# EAGLE design EMG (EAGLE 9.6.2)
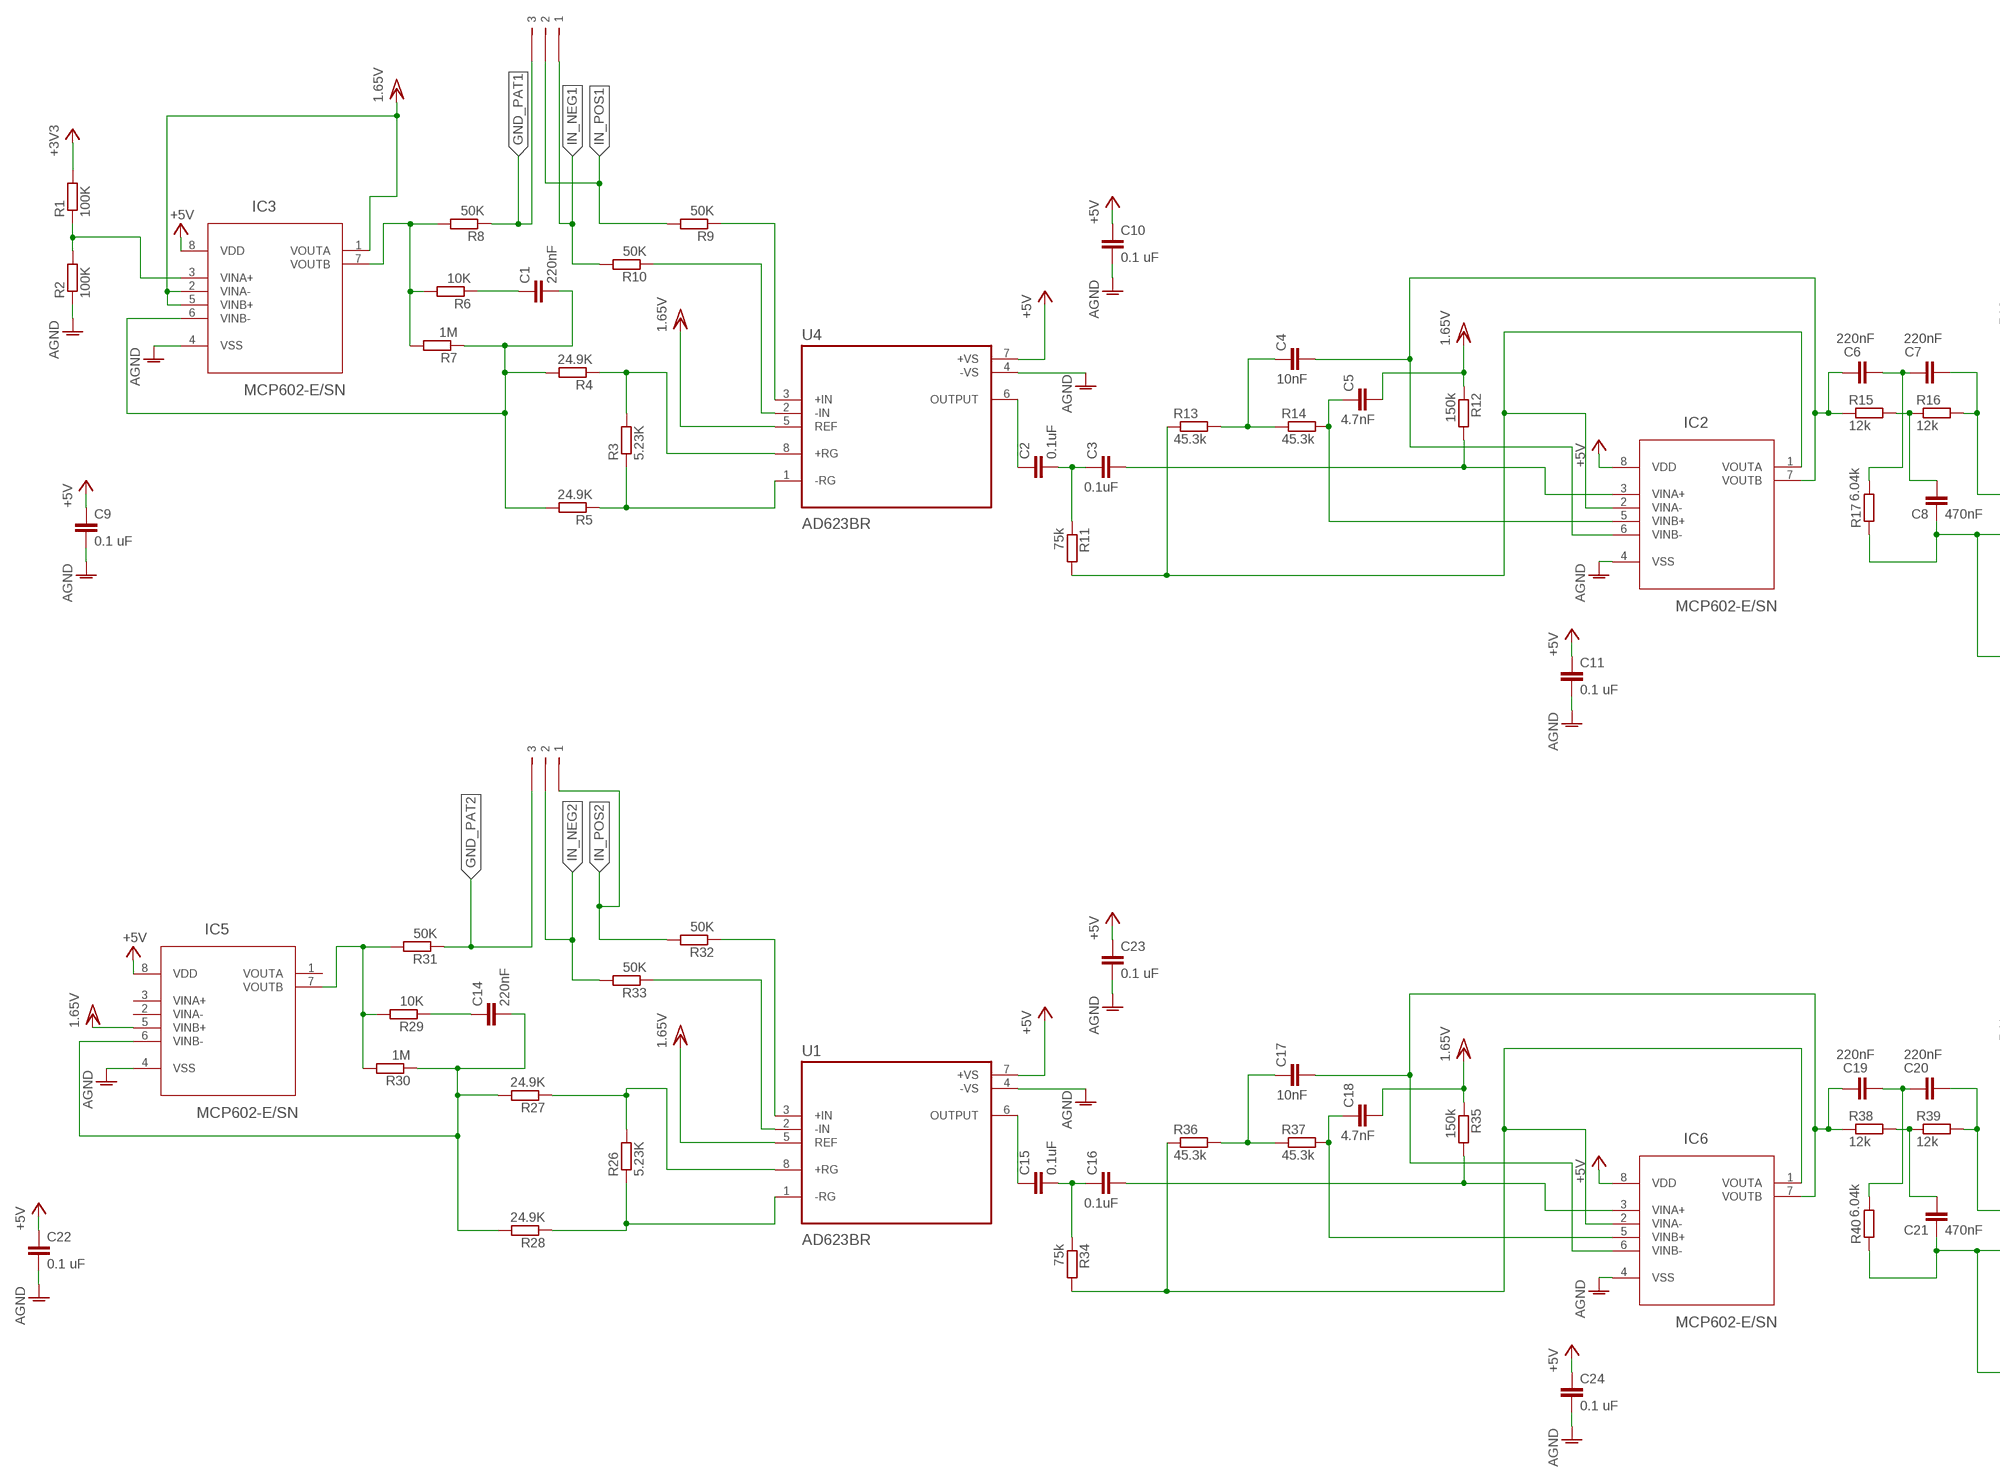
[diagram p0: schematic, sheet 1, part 1 of 2]
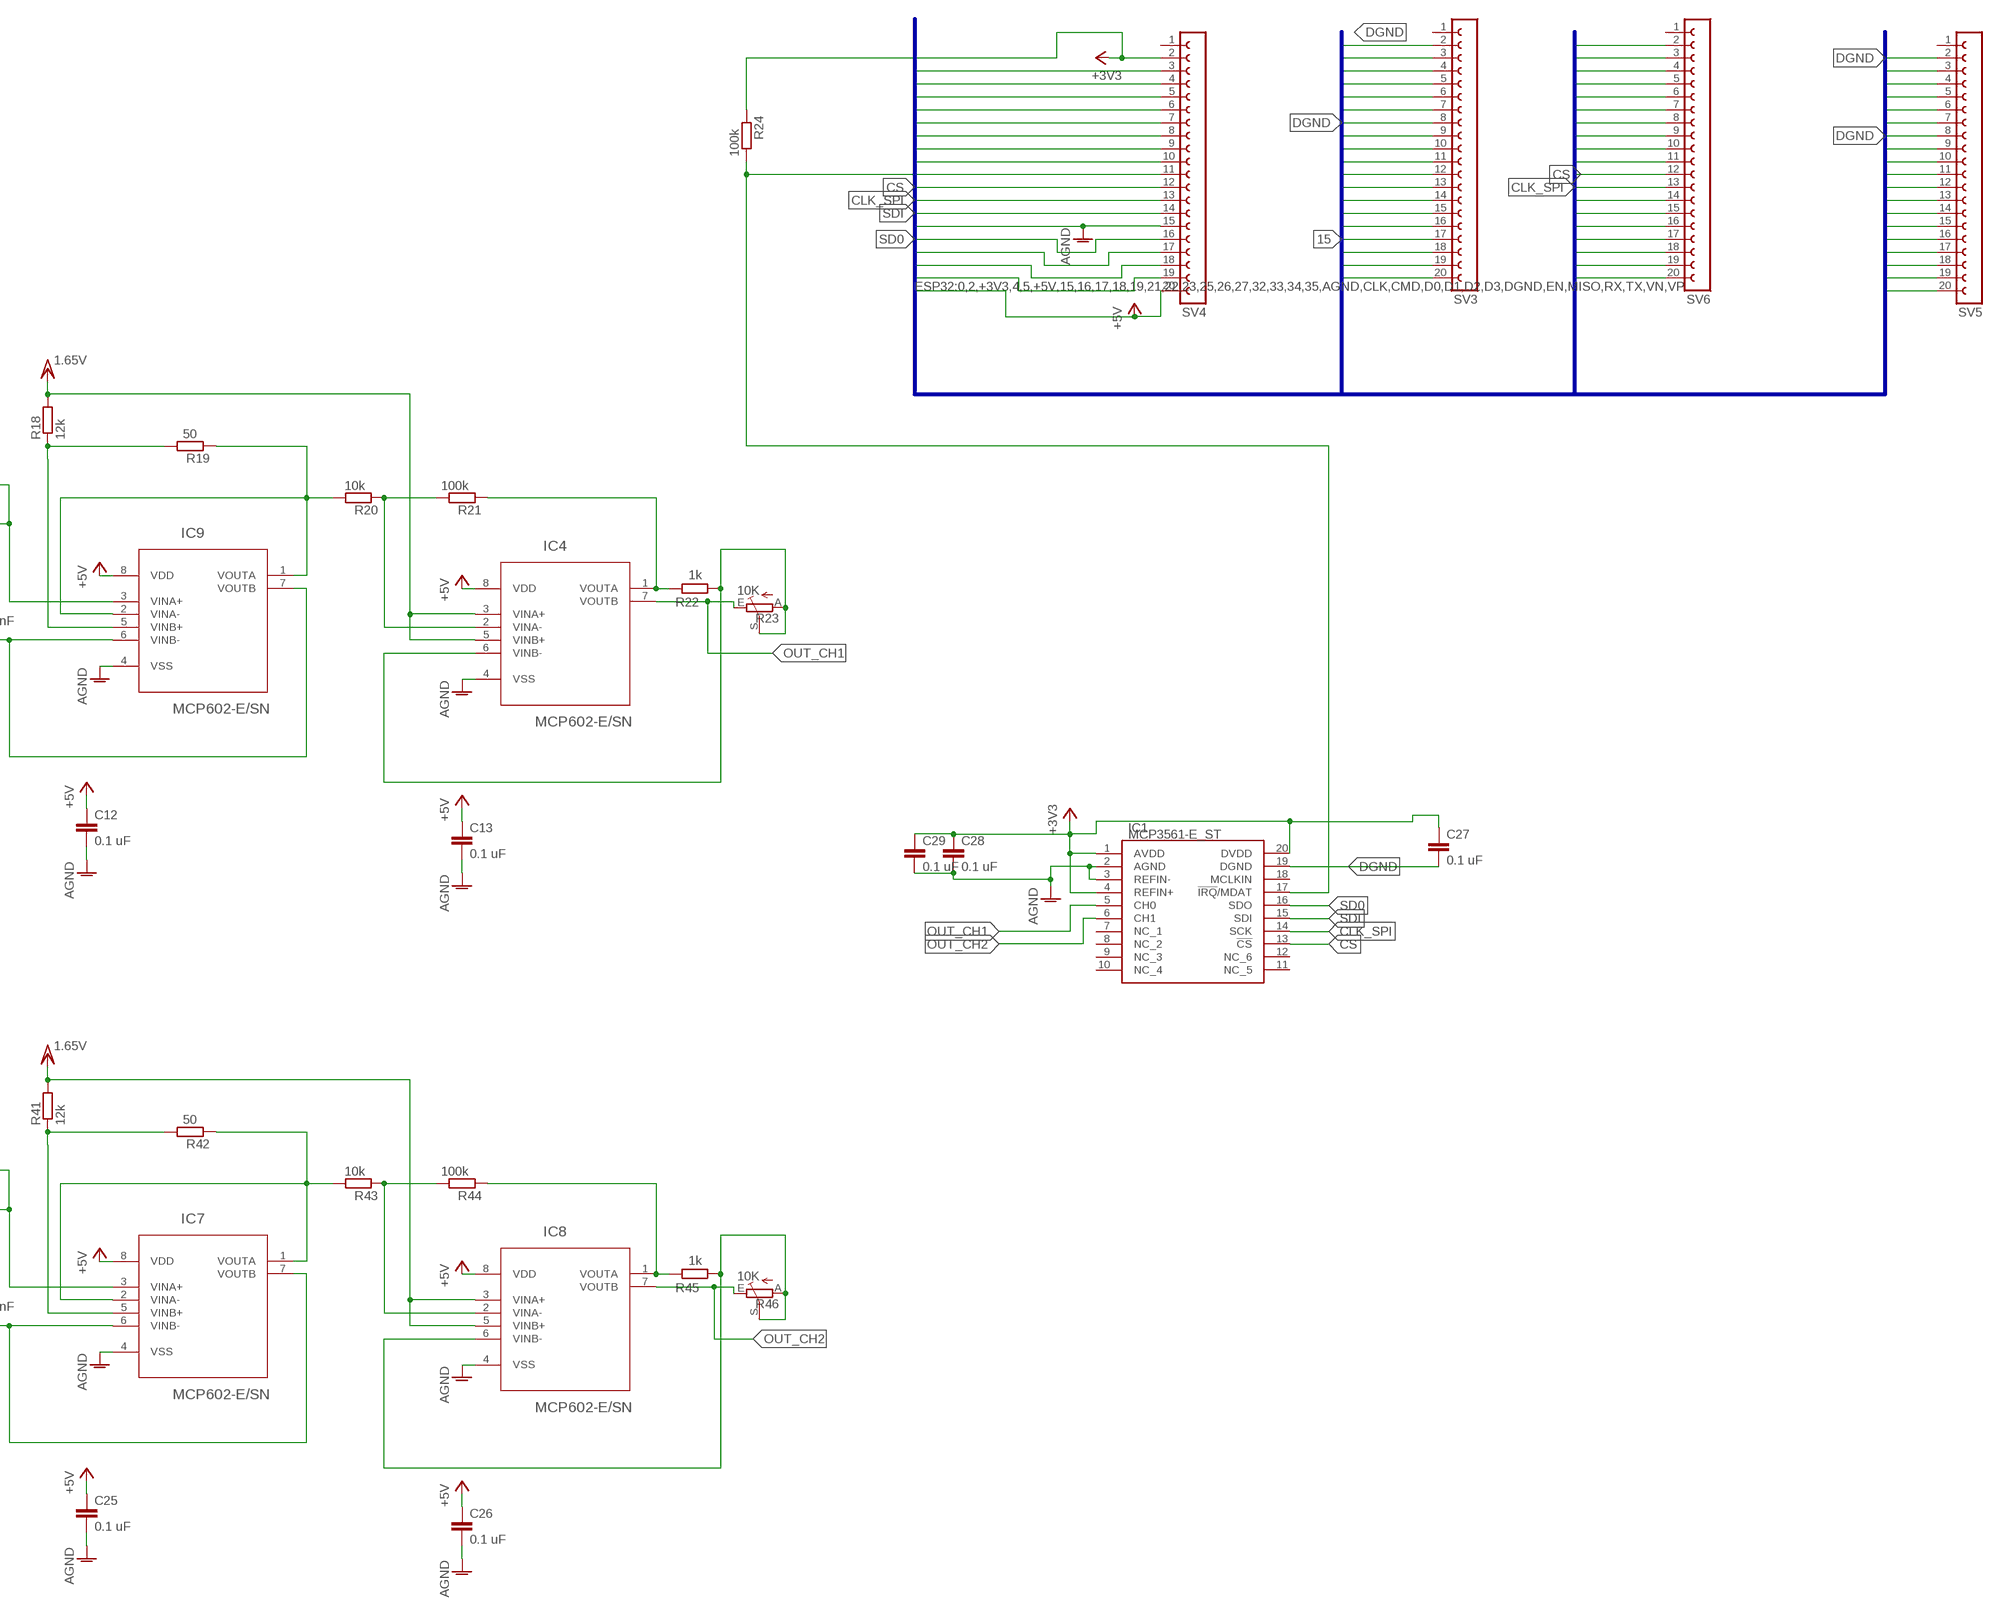
[diagram p1: schematic, sheet 1, part 2 of 2]

## Parts
C1  220nF  C-EUC0402  [C0402]
C2  0.1uF  C-EUC0402  [C0402]
C3  0.1uF  C-EUC0402  [C0402]
C4  10nF  C-EUC0402  [C0402]
C5  4.7nF  C-EUC0402  [C0402]
C6  220nF  C-EUC0402  [C0402]
C7  220nF  C-EUC0402  [C0402]
C8  470nF  C-EUC0402  [C0402]
C9  0.1 uF  C-EUC0402  [C0402]
C10  0.1 uF  C-EUC0402  [C0402]
C11  0.1 uF  C-EUC0402  [C0402]
C12  0.1 uF  C-EUC0402  [C0402]
C13  0.1 uF  C-EUC0402  [C0402]
C14  220nF  C-EUC0402  [C0402]
C15  0.1uF  C-EUC0402  [C0402]
C16  0.1uF  C-EUC0402  [C0402]
C17  10nF  C-EUC0402  [C0402]
C18  4.7nF  C-EUC0402  [C0402]
C19  220nF  C-EUC0402  [C0402]
C20  220nF  C-EUC0402  [C0402]
C21  470nF  C-EUC0402  [C0402]
C22  0.1 uF  C-EUC0402  [C0402]
C23  0.1 uF  C-EUC0402  [C0402]
C24  0.1 uF  C-EUC0402  [C0402]
C25  0.1 uF  C-EUC0402  [C0402]
C26  0.1 uF  C-EUC0402  [C0402]
C27  0.1 uF  C-EUC0402  [C0402]
C28  0.1 uF  C-EUC0402  [C0402]
C29  0.1 uF  C-EUC0402  [C0402]
CON1  PW3  [PWR3]
CON2  PW3  [PWR3]
IC1  MCP3561-E_ST  [SOP65P640X120-20N]
IC2  MCP602-E/SN  [SOIC127P600X175-8N]
IC3  MCP602-E/SN  [SOIC127P600X175-8N]
IC4  MCP602-E/SN  [SOIC127P600X175-8N]
IC5  MCP602-E/SN  [SOIC127P600X175-8N]
IC6  MCP602-E/SN  [SOIC127P600X175-8N]
IC7  MCP602-E/SN  [SOIC127P600X175-8N]
IC8  MCP602-E/SN  [SOIC127P600X175-8N]
IC9  MCP602-E/SN  [SOIC127P600X175-8N]
R1  100K  R-EU_R0402  [R0402]
R2  100K  R-EU_R0402  [R0402]
R3  5.23K  R-EU_R0402  [R0402]
R4  24.9K  R-EU_R0402  [R0402]
R5  24.9K  R-EU_R0402  [R0402]
R6  10K  R-EU_R0402  [R0402]
R7  1M  R-EU_R0402  [R0402]
R8  50K  R-EU_R0402  [R0402]
R9  50K  R-EU_R0402  [R0402]
R10  50K  R-EU_R0402  [R0402]
R11  75k  R-EU_R0402  [R0402]
R12  150k  R-EU_R0402  [R0402]
R13  45.3k  R-EU_R0402  [R0402]
R14  45.3k  R-EU_R0402  [R0402]
R15  12k  R-EU_R0402  [R0402]
R16  12k  R-EU_R0402  [R0402]
R17  6.04k  R-EU_R0402  [R0402]
R18  12k  R-EU_R0402  [R0402]
R19  50  R-EU_R0402  [R0402]
R20  10k  R-EU_R0402  [R0402]
R21  100k  R-EU_R0402  [R0402]
R22  1k  R-EU_R0402  [R0402]
R23  10K  TRIM_EU-CA6V  [CA6V]
R24  100k  R-EU_R0402  [R0402]
R26  5.23K  R-EU_R0402  [R0402]
R27  24.9K  R-EU_R0402  [R0402]
R28  24.9K  R-EU_R0402  [R0402]
R29  10K  R-EU_R0402  [R0402]
R30  1M  R-EU_R0402  [R0402]
R31  50K  R-EU_R0402  [R0402]
R32  50K  R-EU_R0402  [R0402]
R33  50K  R-EU_R0402  [R0402]
R34  75k  R-EU_R0402  [R0402]
R35  150k  R-EU_R0402  [R0402]
R36  45.3k  R-EU_R0402  [R0402]
R37  45.3k  R-EU_R0402  [R0402]
R38  12k  R-EU_R0402  [R0402]
R39  12k  R-EU_R0402  [R0402]
R40  6.04k  R-EU_R0402  [R0402]
R41  12k  R-EU_R0402  [R0402]
R42  50  R-EU_R0402  [R0402]
R43  10k  R-EU_R0402  [R0402]
R44  100k  R-EU_R0402  [R0402]
R45  1k  R-EU_R0402  [R0402]
R46  10K  TRIM_EU-CA6V  [CA6V]
SV3  FE20-1  [FE20]
SV4  FE20-1  [FE20]
SV5  FE20-1  [FE20]
SV6  FE20-1  [FE20]
U1  AD623BR  [SOIC127P600X175-8N]
U4  AD623BR  [SOIC127P600X175-8N]

## Nets
0: SV3.15 SV5.15
2: SV3.16 SV5.16
4: SV3.14 SV5.14
5: SV3.11 SV5.11
15: SV3.17 SV5.17
16: SV3.13 SV5.13
17: SV3.12 SV5.12
18: SV3.10 SV5.10
19: SV3.9 SV5.9
21: SV3.7 SV5.7
22: SV3.4 SV5.4
23: SV3.3 SV5.3
25: SV4.10 SV6.10
26: IC1.17(!IRQ!/MDAT) R24.2 SV4.11 SV6.11
32: SV4.8 SV6.8
33: SV4.9 SV6.9
34: SV4.6 SV6.6
35: SV4.7 SV6.7
+3V3: C27.1 C28.1 C29.1 IC1.1(AVDD) IC1.4(REFIN+) IC1.20(DVDD) R1.2 R24.1 SV4.2 SV6.2
+5V: C9.1 C10.1 C11.1 C12.1 C13.1 C22.1 C23.1 C24.1 C25.1 C26.1 IC2.8(VDD) IC3.8(VDD) IC4.8(VDD) IC5.8(VDD) IC6.8(VDD) IC7.8(VDD) IC8.8(VDD) IC9.8(VDD) SV4.20 SV6.20 U1.7(+VS) U4.7(+VS)
AGND: C9.2 C10.2 C11.2 C12.2 C13.2 C22.2 C23.2 C24.2 C25.2 C26.2 C28.2 C29.2 IC1.2(AGND) IC1.3(REFIN-) IC2.4(VSS) IC3.4(VSS) IC4.4(VSS) IC5.4(VSS) IC6.4(VSS) IC7.4(VSS) IC8.4(VSS) IC9.4(VSS) R2.1 SV4.15 SV6.15 U1.4(-VS) U4.4(-VS)
CLK: SV3.20 SV5.20
CLK_SPI: IC1.14(SCK) SV4.13 SV6.13
CMD: SV4.19 SV6.19
CS: IC1.13(!CS) SV4.12 SV6.12
D0: SV3.19 SV5.19
D1: SV3.18 SV5.18
D2: SV4.17 SV6.17
D3: SV4.18 SV6.18
DGND: C27.2 IC1.19(DGND) SV3.2 SV3.8 SV5.2 SV5.8
EN: SV4.3 SV6.3
GND_PAT1: CON2.P$3 R8.1
GND_PAT2: CON1.P$3 R31.1
IN_NEG1: CON2.P$1 R10.2
IN_NEG2: CON1.P$2 R33.2
IN_POS1: CON2.P$2 R9.2
IN_POS2: CON1.P$1 R32.2
N$1: IC3.3(VINA+) R1.1 R2.2
N$2: C1.2 IC3.6(VINB-) R4.2 R5.2 R7.1
N$3: R3.1 R5.1 U4.1(-RG)
N$4: R3.2 R4.1 U4.8(+RG)
N$5: C2.1 U4.6(OUTPUT)
N$6: C1.1 R6.1
N$7: R9.1 U4.3(+IN)
N$8: R10.1 U4.2(-IN)
N$9: C2.2 C3.1 R11.1
N$10: IC2.1(VOUTA) IC2.2(VINA-) R11.2 R13.1
N$11: C3.2 IC2.3(VINA+) R12.2
N$12: C4.1 R13.2 R14.1
N$13: IC9.1(VOUTA) IC9.2(VINA-) R19.1 R20.2
N$14: C5.1 IC2.5(VINB+) R14.2
N$15: C6.2 C7.1 R17.2
N$16: C8.2 R15.2 R16.1
N$17: C4.2 C6.1 IC2.6(VINB-) IC2.7(VOUTB) R15.1
N$18: C7.2 IC9.3(VINA+) R16.2
N$19: IC9.5(VINB+) R18.1 R19.2
N$20: IC4.2(VINA-) R20.1 R21.2
N$21: C8.1 IC9.6(VINB-) IC9.7(VOUTB) R17.1
N$22: IC4.1(VOUTA) R21.1 R22.1
N$23: IC4.6(VINB-) R22.2 R23.A R23.S
N$26: C14.2 IC5.6(VINB-) R27.2 R28.2 R30.1
N$27: R26.1 R28.1 U1.1(-RG)
N$28: R26.2 R27.1 U1.8(+RG)
N$29: C14.1 R29.1
N$30: R32.1 U1.3(+IN)
N$31: R33.1 U1.2(-IN)
N$32: C15.1 U1.6(OUTPUT)
N$33: C15.2 C16.1 R34.1
N$34: IC6.1(VOUTA) IC6.2(VINA-) R34.2 R36.1
N$35: C16.2 IC6.3(VINA+) R35.2
N$36: C17.1 R36.2 R37.1
N$37: C18.1 IC6.5(VINB+) R37.2
N$38: C19.2 C20.1 R40.2
N$39: C21.2 R38.2 R39.1
N$40: C17.2 C19.1 IC6.6(VINB-) IC6.7(VOUTB) R38.1
N$41: C20.2 IC7.3(VINA+) R39.2
N$42: IC7.1(VOUTA) IC7.2(VINA-) R42.1 R43.2
N$43: C21.1 IC7.6(VINB-) IC7.7(VOUTB) R40.1
N$44: IC7.5(VINB+) R41.1 R42.2
N$45: IC8.2(VINA-) R43.1 R44.2
N$46: IC8.1(VOUTA) R44.1 R45.1
N$47: IC8.6(VINB-) R45.2 R46.A R46.S
OUT_CH1: IC1.5(CH0) IC4.7(VOUTB) R23.E
OUT_CH2: IC1.6(CH1) IC8.7(VOUTB) R46.E
OUT_REF: IC3.7(VOUTB) R6.2 R7.2 R8.2
OUT_REF1: IC5.7(VOUTB) R29.2 R30.2 R31.2
RX: SV3.6 SV5.6
SD0: IC1.16(SDO) SV4.16 SV6.16
SDI: IC1.15(SDI) SV4.14 SV6.14
TX: SV3.5 SV5.5
VCC/2: C5.2 C18.2 IC3.1(VOUTA) IC3.2(VINA-) IC3.5(VINB+) IC4.3(VINA+) IC4.5(VINB+) IC5.5(VINB+) IC8.3(VINA+) IC8.5(VINB+) R12.1 R18.2 R35.1 R41.2 U1.5(REF) U4.5(REF) ; supply symbol labelled 1.65V
VN: SV4.5 SV6.5
VP: SV4.4 SV6.4
Unconnected: IC1.7(NC_1) IC1.8(NC_2) IC1.9(NC_3) IC1.10(NC_4) IC1.11(NC_5) IC1.12(NC_6) IC1.18(MCLKIN) IC5.1(VOUTA) IC5.2(VINA-) IC5.3(VINA+) SV3.1 SV4.1 SV5.1 SV6.1

## Buses
ESP32:0,2,+3V3,4,5,+5V,15,16,17,18,19,21,22,23,25,26,27,32,33,34,35,AGND,CLK,CMD,D0,D1,D2,D3,DGND,EN,MISO,RX,TX,VN,VP

## Library data of the parts
C1-C29 = rcl:C-EU: CAPACITOR, European symbol
CON1 CON2 = Con-pwr:PW3
IC1 = SamacSys_Parts:MCP3561-E_ST: Microchip Technology Source: Datasheet <http://www.microchip.com/mymicrochip/filehandler.aspx?ddocname=en609858>; DESCRIPTION: Microchip Technology; HEIGHT: 1.2mm; MANUFACTURER_NAME: Microchip; MANUFACTURER_PART_NUMBER: MCP3561-E/ST; MOUSER_PART_NUMBER: 579-MCP3561-E/ST; MOUSER_PRICE-STOCK: https://www.mouser.co.uk/ProductDetail/Microchip-Technology-Atmel/MCP3561-E-ST?qs=xZ%2FP%252Ba9zWqYD%252BYb4a9JAwQ%3D%3D
IC2-IC9 = MCP602-E_SN:MCP602-E/SN: CMOS Op Amp Check availability <https://pricing.snapeda.com/parts/MCP602-E/SN/Microchip%20Technology/view-part?ref=eda>; AVAILABILITY: In Stock; DESCRIPTION: CMOS Amplifier 2 Circuit Rail-to-Rail 8-SOIC; MF: Microchip Technology; MP: MCP602-E/SN; PACKAGE: SOIC-8 Microchip; PRICE: None; PURCHASE-URL: https://pricing.snapeda.com/search/part/MCP602-E/SN/?ref=eda
R1-R22 R24 R26-R45 = rcl:R-EU_: RESISTOR, European symbol
R23 R46 = pot:TRIM_EU-: POTENTIOMETER
SV3-SV6 = con-lsta:FE20-1: FEMALE HEADER; OC_FARNELL: unknown; OC_NEWARK: unknown
U1 U4 = AD623BR:AD623BR: None Check availability <https://pricing.snapeda.com/parts/AD623BR/Analog%20Devices/view-part?ref=eda>; AVAILABILITY: In Stock; DESCRIPTION: Instrumentation Amplifier 1 Circuit Rail-to-Rail 8-SOIC; MF: Analog Devices; MP: AD623BR; PACKAGE: SOIC-8 Analog Devices; PRICE: None; PURCHASE-URL: https://pricing.snapeda.com/search/part/AD623BR/?ref=eda

## Board
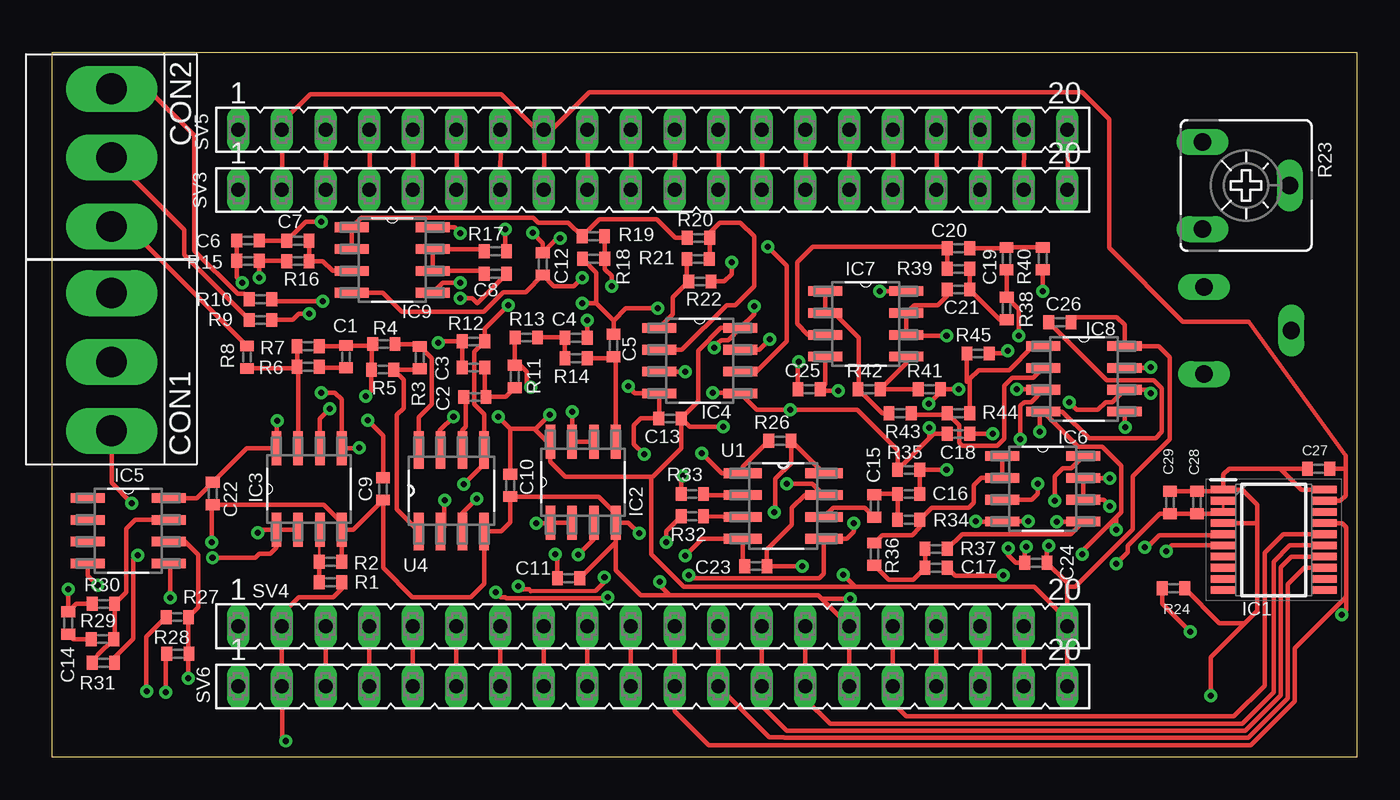
[diagram p2: board, top side]
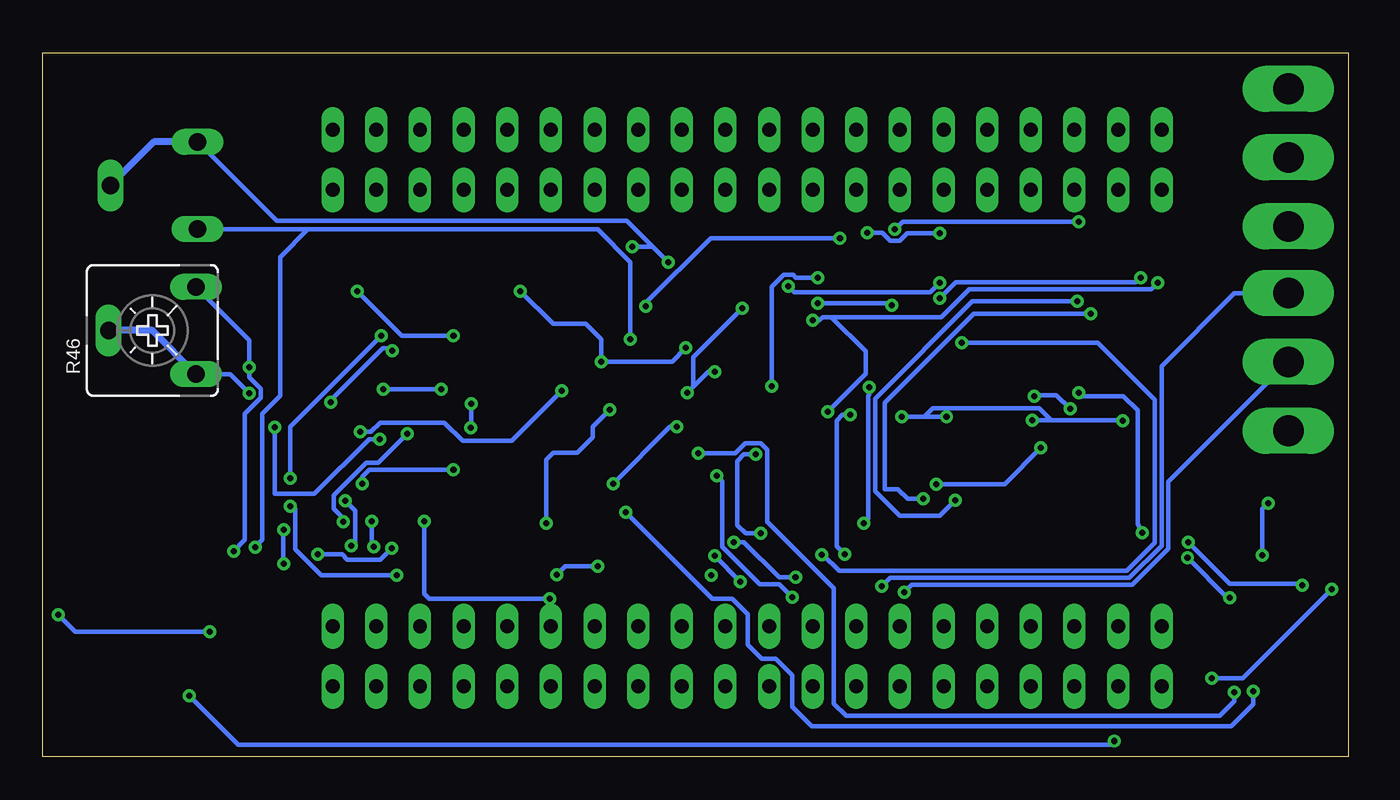
[diagram p3: board, bottom side, seen from below]

Size 76 x 41 mm. Coordinates in mm from the lower left corner, seen from the top.
Outline: 0,0 76,0 76,41 0,41 0,0
Copper layers (1*16): Top 0.035mm / dielectric 1.5mm / Bottom 0.035mm
Design rules "default *": minimum track width 6mil, minimum drill 0.35mm, track to track 6mil, track to pad 6mil, pad to pad 6mil, via to via 6mil, smd to smd 6mil, copper to edge 20mil, drill to drill 6mil, minimum pad ring 10mil, minimum via ring 8mil, stop-mask expansion 4mil, vias tented up to drill 0mil, thermal gap 10mil

### Footprints (pad centres in the part's own frame; a part is rotated, then mirrored left to right if it is on the bottom)
C0402 = smd 0.63 x 0.8: 1 -0.65,0; 2 0.65,0
PWR3 = drill 1.778 pad 2.54 long: P$1 -3.99,0; P$2 0.01,0; P$3 4.02,0
SOP65P640X120-20N = smd 1.475 x 0.45: 1 -2.938,2.925; 2 -2.938,2.275; 3 -2.938,1.625; 4 -2.938,0.975; 5 -2.938,0.325; 6 -2.938,-0.325; 7 -2.938,-0.975; 8 -2.938,-1.625; 9 -2.938,-2.275; 10 -2.938,-2.925; 11 2.938,-2.925; 12 2.938,-2.275; 13 2.938,-1.625; 14 2.938,-0.975; 15 2.938,-0.325; 16 2.938,0.325; 17 2.938,0.975; 18 2.938,1.625; 19 2.938,2.275; 20 2.938,2.925
SOIC127P600X175-8N = smd 1.981 x 0.559: 1 -2.362,1.905; 2 -2.362,0.635; 3 -2.362,-0.635; 4 -2.362,-1.905; 5 2.362,-1.905; 6 2.362,-0.635; 7 2.362,0.635; 8 2.362,1.905
R0402 = smd 0.63 x 0.81: 1 -0.65,0; 2 0.65,0
CA6V = drill 1.016 long: A -2.54,-2.54; E 2.54,-2.54; S 0,2.54
FE20 = drill 0.813 long: 1 -24.13,0; 2 -21.59,0; 3 -19.05,0; 4 -16.51,0; 5 -13.97,0; 6 -11.43,0; 7 -8.89,0; 8 -6.35,0; 9 -3.81,0; 10 -1.27,0; 11 1.27,0; 12 3.81,0; 13 6.35,0; 14 8.89,0; 15 11.43,0; 16 13.97,0; 17 16.51,0; 18 19.05,0; 19 21.59,0; 20 24.13,0
SOIC127P600X175-8N' = smd 2.184 x 0.559: 1 -2.362,1.905; 2 -2.362,0.635; 3 -2.362,-0.635; 4 -2.362,-1.905; 5 2.362,-1.905; 6 2.362,-0.635; 7 2.362,0.635; 8 2.362,1.905

### Placement (x,y rotation side)
C1  17.14,23.29 90 top
C2  24.64,20.95 0 top
C3  24.56,22.66 180 top
C4  30.54,24.39 0 top
C5  32.72,23.94 90 top
C6  11.44,30.05 0 top
C7  14.34,30.04 0 top
C8  25.84,28.12 0 top
C9  19.3,15.6 270 top
C10  26.7,15.8 270 top
C11  30.1,10.4 0 top
C12  28.6,28.7 270 top
C13  36,19.7 180 top
C14  0.97,7.79 90 top
C15  47.9,14.6 90 top
C16  49.9,15.3 0 top
C17  51.5,11 0 top
C18  52.8,18.8 180 top
C19  55.6,29 90 top
C20  52.8,29.6 180 top
C21  52.8,27.2 0 top
C22  9.38,15.33 270 top
C23  41,11.1 180 top
C24  57.3,11.3 180 top
C25  44.1,21.4 0 top
C26  58.7,25.3 180 top
C27  73.76,16.77 0 top
C28  66.68,14.8 270 top
C29  65.11,14.8 270 top
CON1  3.5,23 270 top
CON2  3.5,34.9 270 top
IC1  71.15,12.63 0 top
IC2  30.94,15.99 90 top
IC3  14.99,15.59 90 top
IC4  37.73,23.06 0 top
IC5  4.47,13.16 0 top
IC6  57.7,15.6 0 top
IC7  47.4,25.2 0 top
IC8  60.1,22 0 top
IC9  19.83,28.92 0 top
R1  16.24,10.16 0.3 top
R2  16.24,11.35 180 top
R3  21.44,23.24 90 top
R4  19.34,24.03 180 top
R5  19.28,22.54 180 top
R6  14.94,22.71 180 top
R7  14.94,23.9 180 top
R8  11.38,23.26 270 top
R9  12.16,25.43 180 top
R10  12.16,26.64 180 top
R11  26.97,22.14 90 top
R12  24.56,24.18 180 top
R13  27.64,24.41 0 top
R14  30.54,23.2 0 top
R15  11.44,28.87 0 top
R16  14.34,28.86 0 top
R17  25.84,29.43 0 top
R18  31.56,28.99 180 top
R19  31.54,30.3 0 top
R20  37.66,30.21 180 top
R21  37.64,28.98 0 top
R22  37.74,27.67 0 top
R23  69.54,33.26 270 top
R24  65.31,9.81 180 top
R26  42.4,18.4 0 top
R27  7.32,8.13 0 top
R28  7.35,6 0 top
R29  2.97,6.85 0 top
R30  3.02,8.9 0 top
R31  3.02,5.47 180 top
R32  37.3,14 180 top
R33  37.3,15.3 180 top
R34  49.9,13.8 0 top
R35  49.9,16.7 0 top
R36  47.9,11.8 270 top
R37  51.5,12.1 0 top
R38  55.6,26.1 270 top
R39  52.8,28.4 180 top
R40  57.7,29 90 top
R41  51.1,21.4 0 top
R42  47.6,21.4 0 top
R43  49.4,20 180 top
R44  52.8,20 180 top
R45  53.94,23.48 0 top
R46  69.63,24.82 90 bottom
SV3  35,33 0 top
SV4  35,7.6 0 top
SV5  35,36.5 0 top
SV6  35,4.1 0 top
U1  AD623BR  [SOIC127P600X175-8N']  42.6,14.6 0 top
U4  AD623BR  [SOIC127P600X175-8N']  23.28,15.49 90 top

### Tracks (layer width: path | path; a pad name or v marks a point on that pad's centre or on a via)
0
  Top 0.254: SV5.15 46.48,36.45 SV3.15
2
  Top 0.254: SV5.16 49.02,36.45 SV3.16
4
  Top 0.254: SV5.14 43.94,36.45 SV3.14
5
  Top 0.254: SV5.11 36.32,36.45 SV3.11
15
  Top 0.254: SV5.17 51.56,36.45 SV3.17
16
  Top 0.254: SV5.13 41.4,36.45 SV3.13
17
  Top 0.254: SV3.12 38.86,36.45 SV5.12
18
  Top 0.254: SV5.10 33.78,36.45 SV3.10
19
  Top 0.254: SV5.9 31.24,36.45 SV3.9
21
  Top 0.254: SV5.7 26.16,36.45 SV3.7
22
  Top 0.254: SV5.4 18.54,36.45 SV3.4
23
  Top 0.254: SV5.3 16,36.45 SV3.3
25
  Top 0.254: SV4.10 SV6.10
26  (via drill 0.35)
  Top 0.254: SV4.11 SV6.11 36.27,2.66 38.25,0.68 69.8,0.68 72.37,3.25 72.37,6.33 75.36,9.33 | R24.2 64.66,8.91 v66.29,7.28 | v75.11,8.28 75.36,8.53 75.36,9.33 | IC1.17 75.13,13.61 75.36,13.37 75.36,9.33
  Bottom 0.254: v66.29,7.28 74.11,7.28 v75.11,8.28
32
  Top 0.254: SV4.8 SV6.8
33
  Top 0.254: SV4.9 SV6.9
34
  Top 0.254: SV4.6 SV6.6
35
  Top 0.254: SV4.7 SV6.7
+3V3  (via drill 0.35)
  Top 0.254: 16.34,9.3 | 16.34,9.3 16.4,9.3 16.89,9.79 R1.2 | 16.34,9.3 14.4,9.3 13.41,8.31 SV4.2 SV6.2 13.43,4.08 13.43,1.16 13.63,0.96 v13.63,0.92 | IC1.1 68.11,15.45 C28.1 C29.1 | IC1.1 68.21,16.44 68.55,16.78 71.52,16.78 | IC1.1 69.33,15.55 70.19,14.69 70.19,13.6 | 69.47,7.78 70.19,8.5 70.19,13.6 | 69.47,7.78 67.49,5.8 v67.49,3.55 | IC1.4 70.18,13.61 70.19,13.6 | 71.52,16.78 C27.1 | 71.52,16.78 72.75,15.55 IC1.20 | R24.1 67.99,7.78 69.47,7.78
  Top 0.406: C27.1
  Bottom 0.254: v67.49,3.55 64.64,0.7 13.88,0.7 13.66,0.92 v13.63,0.92
+5V  (via drill 0.35)
  Top 0.152: U4.7 22.6,17.9 22.6,19
  Top 0.254: C10.1 26.7,19.1 | 26.7,19.1 v26,19.8 | C9.1 19.3,18.7 v18.4,19.6 | v13.13,19.57 13.11,19.55 13.11,17.98 IC3.8 11.35,17.95 C22.1 8.46,15.06 IC5.8 | v23.4,19.8 22.6,19 | C11.1 29.45,11.8 v29.33,11.8 | 28.1,19.1 28.85,18.35 IC2.8 29.04,17.16 29.9,16.3 34.9,16.3 | SV4.20 SV6.20 | v28,30.5 28.6,29.9 C12.1 29.45,30.2 v29.6,30.2 | v23.8,30.49 23.47,30.82 IC9.8 | C13.1 37.65,20.7 37.65,23.65 38.97,24.96 IC4.8 | 26.7,19.1 28.1,19.1 | C13.1 36.65,17.95 35,16.3 34.9,16.3 | v29,19.9 28.2,19.1 28.1,19.1 | v40.9,26.24 40.9,25.77 IC4.8 | 34.9,16.3 34.9,11.8 36.8,9.9 46.8,9.9 | 46.8,9.9 57.2,9.9 59.13,7.97 SV4.20 | v42.8,15.9 44.3,15.9 U1.7 43.84,15.23 43.1,14.5 43.1,13.5 41.65,12.05 C23.1 v43.7,11.1 | v39.1,19.2 37.15,19.2 C13.1 | v46.1,10.6 46.8,9.9 | 59.13,9.9 59.13,10.12 C24.1 57.95,12.17 v58.05,12.27 | IC6.8 59.35,16.79 58.86,16.79 58.4,16.34 v58.4,14.9 | C25.1 43.45,22.95 v43.5,23 | IC7.8 v48.2,27.11 | IC4.8 39.38,24.25 38.99,24.25 38.82,24.09 38.82,24.05 v38.57,23.8 | C26.1 59.65,25.6 62,25.6 62.46,25.14 IC8.8 62.47,23.89 64.47,23.89 65.1,23.26 65.1,18.49 62.95,16.34 62.95,13.25 59.6,9.9 59.13,9.9 | SV4.20 59.13,9.9
  Bottom 0.254: v18.4,19.6 17.3,19.6 | v13.13,19.57 13.34,19.57 13.36,19.59 17.29,19.59 17.3,19.6 | v26,19.8 24.7,19.8 | 24.7,19.8 v23.4,19.8 | v29.33,11.8 29.8,12.27 29.8,19.57 29.47,19.9 v29,19.9 | v28,30.5 27.13,30.5 26.67,30.04 26.13,30.04 25.68,30.49 v23.8,30.49 | 17.3,19.6 18,20.3 24.2,20.3 24.7,19.8 | v29.6,30.2 37.13,30.2 40.9,26.43 v40.9,26.24 | v42.8,15.9 39.5,19.2 v39.1,19.2 | v43.7,11.1 45.6,11.1 v46.1,10.6 | v58.05,12.27 57.82,12.5 57.82,14.32 v58.4,14.9 | v48.2,27.11 46.3,25.2 44.4,25.2 43.5,24.3 v43.5,23 39.37,23 v38.57,23.8
AGND  (via drill 0.35)
  Top 0.152: IC1.3 IC1.2
  Top 0.254: IC3.4 17.58,13.23 C9.2 19.3,11 21,9.3 24.4,9.3 25.18,10.09 U4.4 26.18,13.13 26.7,13.65 C10.2 31.85,15.15 32.84,14.15 IC2.4 | C11.2 32.84,12.49 | 32.84,12.49 IC2.4 | SV6.15 SV4.15 44.83,9.2 | IC9.4 19.29,27.02 20.4,25.9 25.15,25.9 26.3,27.05 27.6,27.05 C12.2 29.25,27.4 30.4,27.4 v30.9,27.9 | IC4.4 35.37,21 | 35.37,21 35.37,19.72 C13.2 34.3,19.7 33.9,19.3 33.9,18.2 v34.5,17.6 | 44.83,9.2 44.63,9.4 36,9.4 | 36,9.4 34.3,9.4 32.84,10.86 32.84,12.49 | v33.56,21.56 v33.57,21.56 33.96,21.17 35.2,21.17 35.37,21 | IC2.4 33.57,13.63 v34.2,13 | C23.2 40.24,11.21 U1.4 37.9,12.7 v36.9,11.7 | v35.4,10.2 35.4,10 36,9.4 | v56.73,12.23 56.65,12.15 C24.2 56.14,11.3 55.7,11.74 v55.7,12.14 | v56.87,13.7 IC6.4 v53.8,13.7 | v46.5,9.2 44.83,9.2 | IC7.4 45.04,21.69 44.83,21.48 | 44.83,21.48 C25.2 | IC8.4 58.84,20.09 60.4,18.54 64.27,18.54 64.64,18.91 64.64,21.45 64.17,21.92 61.43,21.92 C26.2 | IC8.4 59.77,18.06 61.17,18.06 62.28,16.95 62.28,14.24 61.95,13.92 | v60,11.8 60,11.97 61.95,13.92 | IC8.4 57.52,19.87 v57.52,18.91 | v45.8,21.3 45,21.3 44.83,21.48 | R2.1 IC3.4 | IC1.3 68.11,14.15 C28.2 65.13,14.14 65.13,14.15 C29.2 64.5,14.15 62.65,12.3 62.65,11.91 v61.98,11.24 | v61.98,13.21 61.98,13.89 61.95,13.92 | IC5.4 2.11,10.55 v2.68,9.98 | v9.33,12.5 9.33,14.63 C22.2 15.84,14.68 16.89,13.62 IC3.4
  Bottom 0.254: v30.9,27.9 32.17,27.9 32.33,28.06 32.87,28.06 33.58,27.35 33.58,21.56 v33.56,21.56 | v34.2,13 35.1,13 35.59,13.49 35.59,17.21 35.2,17.6 v34.5,17.6 | v36.9,11.7 v35.4,10.2 | v56.73,12.23 56.87,12.37 v56.87,13.7 | v53.8,13.7 53.8,9.5 53.5,9.2 51.9,9.2 | 51.9,9.2 | 48.58,9.2 | 48.58,9.2 v46.5,9.2 | 51.9,9.2 48.58,9.2 | v60,11.8 58.59,11.8 58.27,11.48 56.36,11.48 v55.7,12.14 | v57.52,18.91 56.91,18.91 56.37,19.46 52.65,19.46 51.57,18.39 48.72,18.39 v45.8,21.3 | v61.98,11.24 62,11.26 62,13.19 v61.98,13.21 | v2.68,9.98 2.78,10.08 6.91,10.08 v9.33,12.5
CLK
  Top 0.254: SV5.20 59.18,36.45 SV3.20
CLK_SPI
  Top 0.254: SV4.13 SV6.13 41.35,2.98 42.81,1.52 69.49,1.52 71.55,3.58 71.55,11.03 72.17,11.65 IC1.14
CMD
  Top 0.254: SV4.19 SV6.19
CS
  Top 0.254: SV4.12 SV6.12 41.77,1.14 42.61,1.14 42.65,1.11 69.66,1.11 71.96,3.42 71.96,10.04 72.92,11.01 IC1.13
D0
  Top 0.254: SV5.19 56.64,36.45 SV3.19
D1
  Top 0.254: SV5.18 54.1,36.45 SV3.18
D2
  Top 0.254: SV4.17 SV6.17
D3
  Top 0.254: SV4.18 SV6.18
DGND
  Top 0.254: SV3.2 13.46,36.45 SV5.2 13.41,36.93 15.06,38.58 26.17,38.58 28.25,36.5 SV5.8 | SV5.8 28.7,36.45 SV3.8 | IC1.19 75.03,14.9 75.33,15.2 75.33,16.77 | SV5.8 29.12,36.5 31.31,38.69 60,38.69 61.57,37.12 61.57,29.63 65.86,25.34 69.7,25.34 75.33,17.53 75.33,16.77 | C27.2 75.33,16.77
EN
  Top 0.254: SV4.3 SV6.3
GND_PAT1
  Top 0.254: R8.1 4.41,30.88 CON2.P$3
GND_PAT2  (via drill 0.35)
  Top 0.254: v5.02,11.74 4.77,11.49 4.77,6.88 3.67,5.79 R31.1 | v4.68,14.77 3.5,15.95 CON1.P$3
  Bottom 0.254: v5.02,11.74 5.02,14.43 v4.68,14.77
IN_NEG1
  Top 0.254: R10.2 11.21,26.94 10.83,26.94 8.3,29.47 8.3,36.17 5.58,38.89 CON2.P$1
IN_NEG2  (via drill 0.35)
  Top 0.254: R33.2 36.65,16.25 v36.77,16.37 | v25.86,9.57 26.14,9.29 26.41,9.29 26.46,9.24 32.34,9.24 v32.39,9.29
  Bottom 0.254: v36.77,16.37 36.45,16.05 36.45,12.22 34.26,10.03 33.13,10.03 v32.39,9.29 | v25.86,9.57 25.42,10.01 12.58,10.01 10.48,12.11 10.48,16.01 CON1.P$2
IN_POS1
  Top 0.254: R9.2 7.72,29.22 7.72,30.67 CON2.P$2
IN_POS2  (via drill 0.35)
  Top 0.254: R32.2 35.79,13.14 v35.79,12.49 | v32.19,10.44 32.19,10.16 31.69,9.66 27.91,9.65 27.8,9.76 27.5,9.76 v27.16,9.94
  Bottom 0.254: v32.19,10.44 33.15,10.44 35.2,12.49 v35.79,12.49 | v27.16,9.94 26.69,10.41 12.75,10.41 10.88,12.28 10.88,22.75 6.64,26.99 CON1.P$1
N$1
  Top 0.152: 15.55,11.31 R2.2 15.59,13.19 IC3.3
  Top 0.254: 15.55,11.31 15.59,11.27 R1.1
N$2  (via drill 0.35)
  Top 0.254: R7.1 17.1,23.9 C1.2 18.6,23.94 R4.2 18.63,23.97 R5.2 18.6,22.51 18.6,21.3 v18.3,21 | v16.2,20.26 15.62,19.68 IC3.6
  Bottom 0.254: v18.3,21 18.24,21.06 17,21.06 v16.2,20.26
N$3
  Top 0.254: R3.1 21.39,22.54 R5.1 19.9,22.54 20.5,21.94 20.5,20.3 20.1,19.9 20.1,14.4 U4.1
N$4
  Top 0.254: R4.1 21.3,24.03 R3.2 22.12,23.21 22.12,20.52 21.38,19.77 U4.8
N$5
  Top 0.254: U4.6 23.91,19.02 24.1,19.2 24.1,20.84 C2.1
N$6
  Top 0.254: C1.1 15.66,22.64 R6.1
N$7  (via drill 0.35)
  Top 0.254: v24.75,15.02 23.91,14.19 U4.3 | v15,25.8 14.4,25.8 14.03,25.43 R9.1
  Bottom 0.254: v24.75,15.02 25.66,15.02 26.23,15.59 27,15.59 27,20.6 21.8,25.8 v15,25.8
N$8  (via drill 0.35)
  Top 0.152: 12.94,26.51 R10.1
  Top 0.254: U4.2 22.88,13.36 22.88,14.85 v22.88,14.93 | v15.8,26.51 12.94,26.51
  Bottom 0.254: v22.88,14.93 23.79,14.02 26.11,14.02 27.55,15.46 27.55,20.85 21.89,26.51 v15.8,26.51
N$9
  Top 0.254: R11.1 26.43,20.95 C2.2 25.21,21.03 C3.1
N$10  (via drill 0.35)
  Top 0.254: R13.1 26.97,24.39 R11.2 27.29,22.79 27.65,22.42 27.65,21.75 v27.91,21.5 | IC2.2 IC2.1 29.01,13.6 v28.21,13.6
  Bottom 0.254: v28.21,13.6 27.96,13.85 27.96,21.02 27.91,21.07 v27.91,21.5
N$11  (via drill 0.35)
  Top 0.254: IC2.3 31.57,12.67 v30.67,11.76 | v22.5,24.1 22.58,24.18 R12.2 C3.2
  Bottom 0.254: v30.67,11.76 30.59,11.76 29.65,10.82 12.92,10.82 11.29,12.45 11.29,20.79 14.6,24.1 v22.5,24.1
N$12
  Top 0.254: R13.2 29.87,24.41 C4.1 R14.1
N$13
  Top 0.254: IC9.2 IC9.1 18.03,31.38 28.05,31.38 28.33,31.1 30.09,31.1 R19.1 31.89,31.3 35.22,31.3 36.31,30.21 R20.2
N$14
  Top 0.254: R14.2 32.63,23.2 C5.1 32.84,23.16 IC2.5
N$15  (via drill 0.35)
  Top 0.254: C6.2 C7.1 14.8,31.15 v15.7,31.15 | v26.4,30.7 26.4,29.52 R17.2
  Bottom 0.254: v15.7,31.15 25.95,31.15 v26.4,30.7
N$16  (via drill 0.35)
  Top 0.254: R16.1 R15.2 v12.1,27.9 | C8.2 24.77,26.4 24.48,26.68 v23.79,26.68
  Bottom 0.254: v12.1,27.9 12.38,27.62 22.85,27.62 v23.79,26.68
N$17  (via drill 0.35)
  Top 0.152: v31.2,25.4 31.2,25.3 31.19,25.29
  Top 0.254: IC2.6 IC2.7 v30.3,20.09 v30.3,20.1 | v11.1,27.6 10.79,27.91 R15.1 C6.1 | C4.2 31.19,25.29
  Bottom 0.254: 30.1,25.6 30.6,25.6 30.8,25.4 v31.2,25.4 | 30.1,25.6 28.1,23.6 28.1,22.3 v30.3,20.1 | 30.1,25.6 23.7,25.6 22.09,27.21 11.49,27.21 v11.1,27.6
N$18
  Top 0.254: C7.2 R16.2 15.79,28.86 16.37,28.29 IC9.3
N$19  (via drill 0.35)
  Top 0.254: R19.2 32.21,30.28 R18.1 32.21,28.39 32.6,28 v32.6,27.4 | IC9.5 22.78,27.6 v23.8,27.6
  Bottom 0.254: v23.8,27.6 24.34,27.06 32.26,27.06 v32.6,27.4
N$20
  Top 0.254: IC4.2 36.7,23.7 39.3,26.3 39.8,26.3 40.9,27.4 40.9,30.3 40.1,31.1 38.9,31.1 38.31,30.51 R20.1 38.31,29 R21.2
N$21
  Top 0.254: R17.1 25.07,29.55 IC9.7 IC9.6 25.02,28.29 C8.1
N$22
  Top 0.254: R21.1 36.99,27.77 R22.1 36.17,26.75 36.17,25.77 IC4.1
N$23  (via drill 0.35)
  Top 0.254: v39.6,28.8 39.6,28.1 39.17,27.67 R22.2 | IC4.6 41.02,22.43 42.8,24.2 42.8,28.6 v41.7,29.7
  Bottom 0.254: R23.A 62.4,31.2 42,31.2 40.55,29.75 | 40.55,29.75 v39.6,28.8 | v41.7,29.7 40.6,29.7 40.55,29.75
  Bottom 0.406: R23.A 69.54,35.8 R23.S
N$26  (via drill 0.35)
  Top 0.254: R30.1 1.43,8.9 C14.2 v0.97,9.76 | 7.97,6.03 R27.2 8.54,8.7 8.54,11.75 7.76,12.53 IC5.6 | 7.97,6.03 v7.97,4.56 | 7.97,6.03 R28.2
  Bottom 0.254: v0.97,9.76 6.16,4.57 v7.97,4.57 v7.97,4.56
N$27  (via drill 0.35)
  Top 0.254: R26.1 40.24,16.89 U1.1 39.02,16.5 v37.84,17.68 | v6.66,3.76 6.66,5.96 R28.1
  Bottom 0.254: v6.66,3.76 6.66,3.22 7.5,2.38 29.25,2.38 29.96,3.09 29.96,9.8 33.84,13.68 33.84,17.87 34.23,18.26 35.12,18.26 35.7,17.68 v37.84,17.68
N$28  (via drill 0.35)
  Top 0.254: U1.8 43.07,18.4 R26.2 43.05,17.08 42.14,16.17 42.14,14.31 v42.06,14.23 | v5.53,3.82 v5.52,3.83 5.52,7 6.66,8.13 R27.1
  Bottom 0.254: v42.06,14.23 37.03,9.2 35.88,9.2 34.97,8.29 34.97,6.51 34.16,5.7 33.34,5.7 32.38,4.74 32.38,2.92 31.24,1.78 6.82,1.78 5.53,3.07 v5.53,3.82
N$29
  Top 0.254: C14.1 1.26,6.85 R29.1
N$30
  Top 0.254: R32.1 40.22,13.95 U1.3
N$31
  Top 0.254: R33.1 38.02,15.23 U1.2
N$32
  Top 0.254: U1.6 45.5,14.5 47.35,14.5 C15.1
N$33
  Top 0.254: C15.2 47.95,15.3 C16.1 R34.1
N$34
  Top 0.254: R36.1 48.35,12.9 50.1,12.9 50.55,13.35 R34.2 51.25,14.5 53.4,14.5 53.7,14.8 53.7,15.8 54.13,16.23 IC6.2 IC6.1
N$35  (via drill 0.35)
  Top 0.254: C16.2 R35.2 v52.1,16.7 | v57.4,15.9 57.4,15.3 57.06,14.96 IC6.3
  Bottom 0.254: v52.1,16.7 57,16.7 57.4,16.3 v57.4,15.9
N$36
  Top 0.254: R36.2 48.74,10.31 50.16,10.31 C17.1 R37.1
N$37  (via drill 0.35)
  Top 0.254: R37.2 53.01,12.96 59.33,12.96 IC6.5 v58.53,13.69 | C18.1 v54.8,18.8
  Bottom 0.254: v54.8,18.8 56.49,17.11 57.17,17.11 59.06,15.22 59.06,14.43 58.53,13.9 v58.53,13.69
N$38
  Top 0.254: C20.1 55.55,29.6 C19.2 R40.2
N$39
  Top 0.254: R39.1 C21.2 55.2,25.45 R38.2
N$40  (via drill 0.35)
  Top 0.254: C17.2 52.6,10.55 55.39,10.55 v55.4,10.56 | v61.62,14.59 61.24,14.96 IC6.6 60.06,16.21 | 60.06,16.21 IC6.7 | C19.1 R38.1 56.3,26.05 v56.3,24.5 | v61.6,16.21 60.06,16.21
  Bottom 0.254: v55.4,10.56 59.8,10.56 61.32,12.08 61.32,14.44 61.46,14.44 v61.62,14.59 | v56.3,24.5 61.6,19.2 v61.6,16.21
N$41
  Top 0.254: IC7.3 44.03,24.57 43.4,25.2 43.4,28.8 44.3,29.7 52.05,29.7 C20.2 R39.2
N$42
  Top 0.254: IC7.1 IC7.2 45.56,25.84 47,24.4 47,21.45 R42.1 48.35,20 R43.2
N$43  (via drill 0.35)
  Top 0.254: C21.1 52.15,26.85 51.6,26.3 50.23,26.3 IC7.7 IC7.6 49.83,24.5 v52.1,24.5 | R40.1 v57.7,27.1
  Bottom 0.254: v57.7,27.1 55.1,24.5 v52.1,24.5
N$44
  Top 0.254: IC7.5 49.76,22.91 R42.2 R41.1
N$45
  Top 0.254: R43.1 50.15,19.9 52.05,19.9 R44.2 52.86,19.29 52.86,18.28 53.02,18.12 55.05,18.12 55.46,18.53 55.46,21.59 55.93,22.06 57.16,22.06 IC8.2
N$46
  Top 0.254: R44.1 53.45,21.12 53.46,21.13 53.46,21.67 53.45,21.68 53.45,22 | R45.1 53.29,21.84 53.45,22 | IC8.1 57.13,23.91 55.75,22.52 53.97,22.52 53.45,22
N$47  (via drill 0.35)
  Top 0.254: R45.2 55.5,23.48 v55.67,23.65 | v59.23,20.64 59.67,20.2 60.9,20.2 61.36,20.65 61.75,20.65 IC8.6 63.79,21.36 v63.98,21.17
  Bottom 0.254: v55.67,23.65 55.8,23.78 56.22,23.78 59.3,20.7 v59.23,20.64 | v63.98,21.17 65.1,22.28 R46.A
  Bottom 0.406: R46.A 69.63,24.82 R46.S
OUT_CH1  (via drill 0.35)
  Top 0.254: IC4.7 41.2,23.7 v41.8,24.3 | v63.64,12.21 63.79,12.21 64.48,12.9 68.16,12.9 IC1.5
  Bottom 0.254: v41.8,24.3 41.8,28.8 43.7,30.7 60.57,30.7 | R23.E 66.98,30.7 60.57,30.7 | v63.64,12.21 63.22,12.63 63.22,12.74 63.22,19.97 62.19,21.01 62.19,29.08 60.57,30.7
OUT_CH2  (via drill 0.35)
  Top 0.254: IC8.7 63.94,22.64 v63.99,22.69 | IC1.6 65.22,12.3 v64.89,11.98
  Bottom 0.254: R46.E 63.99,24.26 v63.99,22.69 63.99,22.11 63.33,21.44 63.33,20.89 64.24,19.98 64.24,12.63 v64.89,11.98
OUT_REF
  Top 0.254: IC3.7 14.36,22.5 | 14.36,22.5 14.36,22.64 R6.2 R7.2 | R8.2 14.24,22.61 14.36,22.5
OUT_REF1
  Top 0.254: R31.2 2.7,5.93 R29.2 3.67,6.9 R30.2 4.36,9.59 4.36,13.29 4.87,13.79 IC5.7
RX
  Top 0.254: SV5.6 23.62,36.45 SV3.6
SD0
  Top 0.254: SV4.16 SV6.16 48.97,3.15 49.76,2.36 68.83,2.36 70.62,4.15 70.62,11.87 71.71,12.96 IC1.16
SDI
  Top 0.254: SV4.14 SV6.14 43.89,3.36 45.33,1.92 69.32,1.92 71.15,3.75 71.15,11.36 72.09,12.3 IC1.15
TX
  Top 0.254: SV5.5 21.08,36.45 SV3.5
VCC/2  (via drill 0.35)
  Top 0.254: v15.7,21.2 16.5,21.2 16.89,20.8 IC3.5 17.85,17.95 v17.9,18 | IC3.1 IC3.2 | v26.6,26.3 25.21,24.91 R12.1 24.62,23.59 24.62,20.51 25.18,19.95 U4.5 25.18,17.05 v24.01,15.88 | C5.2 32.72,25.39 | 32.72,25.39 31.71,26.4 | v30.9,26.4 31.71,26.4 | R18.2 31.71,28.19 31.71,26.4 | IC4.3 v36.9,22.43 v36.9,22.42 | v38.5,21.2 40.05,21.2 IC4.5 41.05,20.2 v43,20.2 46.9,20.2 49.25,17.85 R35.1 51.1,18.55 | v35.3,26.1 33.43,26.1 32.72,25.39 | v37.1,10.56 37.26,10.4 44.7,10.4 44.96,10.66 U1.5 46.3,12.7 46.7,13.1 v46.7,13.6 | 51.1,18.55 51.35,18.8 C18.2 | v52.8,21.4 R41.2 51.75,21.23 v51.08,20.56 | v56.2,21.4 57.7,21.4 IC8.3 57.03,20.65 56.63,20.65 56.4,20.42 v56.4,18.5 | v62.5,19.19 62.46,19.23 IC8.5 | v51.1,19.14 51.1,18.55 | IC3.1 13.09,12.18 12.73,11.82 12.08,11.82 11.85,11.59 v9.37,11.59 | v6.9,9.26 6.9,11.19 IC5.5 | v12,13.05 12.18,13.23 IC3.1
  Bottom 0.254: v15.7,21.2 15.5,21 13.1,21 12.27,20.17 12.27,13.57 v12,13.05 | v30.9,26.4 26.6,26.4 v26.6,26.3 | v17.9,18 20.02,15.88 v24.01,15.88 | v36.9,22.42 37.28,22.42 38.15,21.55 | 38.15,21.55 v38.5,21.2 | 38.15,21.55 38.15,23.25 v35.3,26.1 | v43,20.2 44,19.2 44,18.6 44.9,17.7 46.3,17.7 46.7,17.3 v46.7,13.6 | v52.8,21.4 v56.2,21.4 | v56.4,18.5 57,18.5 60.2,15.3 62.5,15.3 v62.5,19.19 | v51.08,20.56 51.08,19.16 v51.1,19.14 | v9.37,11.59 6.99,9.21 6.99,9.17 v6.9,9.26
VN
  Top 0.254: SV4.5 SV6.5
VP
  Top 0.254: SV4.4 SV6.4